# Altium project BRCM-V2-Master.PrjPCB
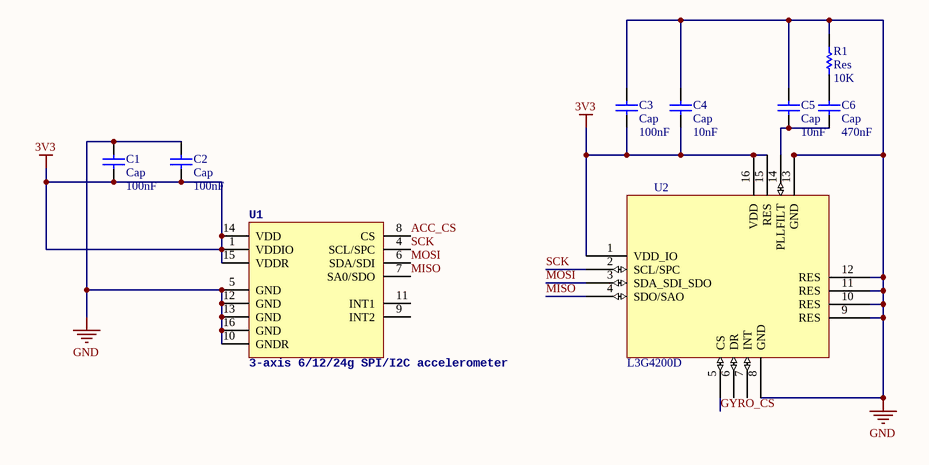
[diagram p0: IMU Sensor.SchDoc]
5 sheets, 95 parts. Net scope: global (net labels, ports and power ports of the same name join across sheets).
Board files: BRCM-V2-Master.PcbDoc, BRCM-V2.1-Master.PcbDoc
Sheets:
  IMU Sensor.SchDoc
  Power Conversion.SchDoc
  Dynamixel Power.SchDoc
  Communication.SchDoc
  Main System.SchDoc

## Sheet IMU Sensor.SchDoc
size A4

### Parts
C1  Cap  value 100nF  [0603-CAP]
C2  Cap  value 100nF  [0603-CAP]
C3  Cap  value 100nF  [0603-CAP]
C4  Cap  value 10nF  [0603-CAP]
C5  Cap  value 10nF  [0603-CAP]
C6  Cap  value 470nF  [0603-CAP]
R1  Res  value 10K  [0603-RES]
U1  3-axis 6/12/24g SPI/I2C accelerometer  [LGA16-3MM]
U2  L3G4200D  [L3G4200D]

### Nets
3V3: C1.1 C2.1 C3.1 C4.1 U1.1(VDDIO) U1.14(VDD) U1.15(VDDR) U2.1(VDD_IO) U2.15(RES) U2.16(VDD)
GND: C1.2 C2.2 C3.2 C4.2 C5.1 R1.2 U1.5(GND) U1.10(GNDR) U1.12(GND) U1.13(GND) U1.16(GND) U2.8(GND) U2.9(RES) U2.10(RES) U2.11(RES) U2.12(RES) U2.13(GND)
ACC_CS: U1.8(CS)
GYRO_CS: U2.5(CS)
MISO: U1.7(SA0/SDO) U2.4(SDO/SAO)
MOSI: U1.6(SDA/SDI) U2.3(SDA_SDI_SDO)
SCK: U1.4(SCL/SPC) U2.2(SCL/SPC)
NetC5_2: C5.2 C6.1 U2.14(PLLFILT)
NetC6_2: C6.2 R1.1

Not connected (* = marked no-connect by the designer): U1 9(INT2) 11(INT1); U2 6(DR) 7(INT)

### Library data of the parts
C1-C6 = Cap: Capacitor; Published: 8-Jun-2000; LatestRevisionDate: 17-Jul-2002; LatestRevisionNote: Re-released for DXP Platform.; PackageReference: RAD-0.3; Publisher: Altium Limited; PackageDescription: Radial Cap, Thru-Hole; 2 Leads; 0.3 in Pin Spacing
R1 = Res: Resistor; Published: 8-Jun-2000; LatestRevisionDate: 17-Jul-2002; LatestRevisionNote: Re-released for DXP Platform.; PackageReference: AXIAL-0.3; Publisher: Altium Limited; PackageDescription: Axial Device, Thru-Hole; 2 Leads; 0.3 in Pin Spacing
U1 = LIS331

## Sheet Power Conversion.SchDoc
size A4
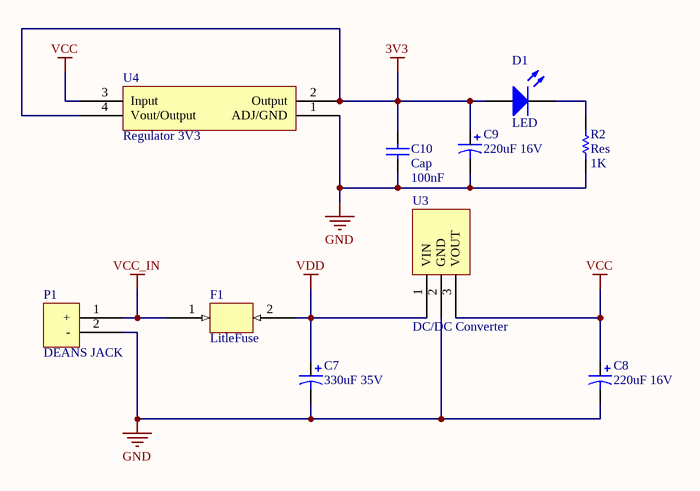
[diagram p1: Power Conversion.SchDoc]

### Parts
(Parts that share a designator on the sheet are numbered #1, #2 ... from top to bottom, then left to right.)
C7  330uF 35V  [CAP 330uF 35V SMD]
C8  220uF 16V  [CAP 220uF 16V]
C9  220uF 16V  [CAP 220uF 16V]
C10  Cap  value 100nF  [0603-CAP]
D1  LED  [CHIPLED_0603]
F1  LitleFuse  [LitleFuse]
P1  DEANS JACK  [Deans Jack]
R2  Res  value 1K  [0603-RES]
U3  DC/DC Converter  [DC/DC Converter]
U4#1  Regulator 3V3  [Regulator 3V3 SOT230]

### Nets
3V3: C9.1 C10.1 D1.1(A) U4#1.2(Output) U4#1.4(Vout/Output)
GND: C7.2 C8.2 C9.2 C10.2 P1.2(-) R2.1 U3.2(GND) U4#1.1(ADJ/GND)
VCC: C8.1 U3.3(VOUT) U4#1.3(Input)
VCC_IN: F1.1 P1.1(+)
VDD: C7.1 F1.2 U3.1(VIN)
NetD1_2: D1.2(K) R2.2

### Library data of the parts
C10 = Cap: Capacitor; Published: 8-Jun-2000; LatestRevisionDate: 17-Jul-2002; LatestRevisionNote: Re-released for DXP Platform.; PackageReference: RAD-0.3; Publisher: Altium Limited; PackageDescription: Radial Cap, Thru-Hole; 2 Leads; 0.3 in Pin Spacing
D1 = LED: Typical INFRARED GaAs LED; Published: 8-Jun-2000; LatestRevisionDate: 08-Jul-2005; LatestRevisionNote: Mech Layer 1 removed.; PackageReference: LED-0; Publisher: Altium Limited; PackageDescription: LED; 2 Leads
R2 = Res: Resistor; Published: 8-Jun-2000; LatestRevisionDate: 17-Jul-2002; LatestRevisionNote: Re-released for DXP Platform.; PackageReference: AXIAL-0.3; Publisher: Altium Limited; PackageDescription: Axial Device, Thru-Hole; 2 Leads; 0.3 in Pin Spacing

## Sheet Dynamixel Power.SchDoc
size A4
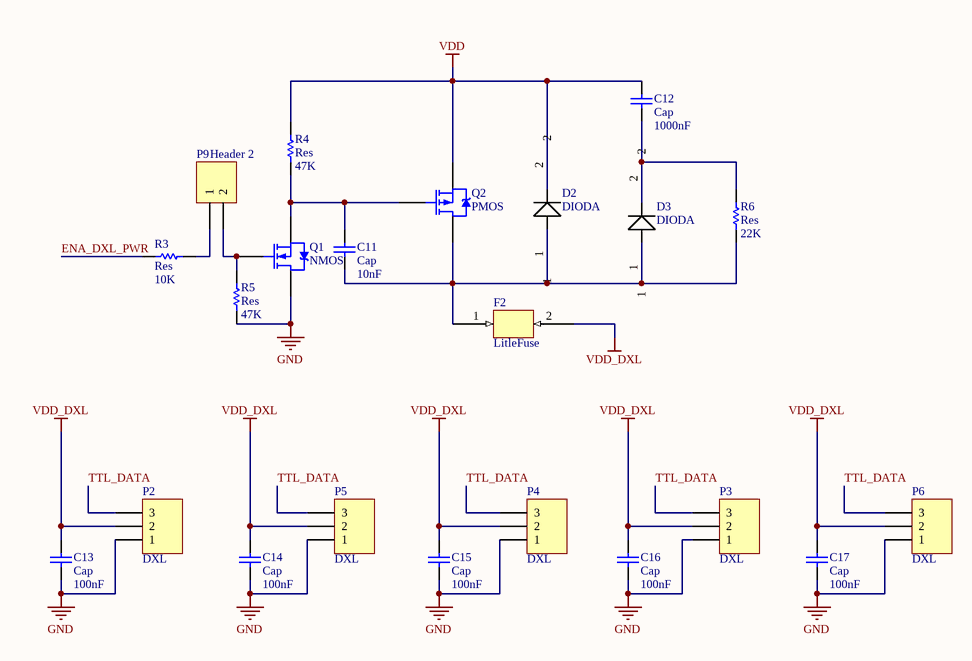
[diagram p2: Dynamixel Power.SchDoc]

### Parts
C11  Cap  value 10nF  [0603-CAP]
C12  Cap  value 1000nF  [0603-CAP]
C13  Cap  value 100nF  [0603-CAP]
C14  Cap  value 100nF  [0603-CAP]
C15  Cap  value 100nF  [0603-CAP]
C16  Cap  value 100nF  [0603-CAP]
C17  Cap  value 100nF  [0603-CAP]
D2  DIODA  [DIODE SS14 SODFL]
D3  DIODA  [DIODE SS14 SODFL]
F2  LitleFuse  [LitleFuse]
P2  DXL  [DXL]
P3  DXL  [DXL]
P4  DXL  [DXL]
P5  DXL  [DXL]
P6  DXL  [DXL]
P9  Header 2  [HDR1X2]
Q1  NMOS  [SOT23]
Q2  PMOS  [TO263]
R3  Res  value 10K  [0603-RES]
R4  Res  value 47K  [0603-RES]
R5  Res  value 47K  [0603-RES]
R6  Res  value 22K  [0603-RES]

### Nets
GND: C13.1 C14.1 C15.1 C16.1 C17.1 P2.1 P3.1 P4.1 P5.1 P6.1 Q1.3(D) R5.1
VDD: C12.2 D2.2 Q2.2(S) R4.2
VDD_DXL: C13.2 C14.2 C15.2 C16.2 C17.2 F2.2 P2.2 P3.2 P4.2 P5.2 P6.2
ENA_DXL_PWR: R3.1
TTL_DATA: P2.3 P3.3 P4.3 P5.3 P6.3
NetC11_1: C11.1 D2.1 D3.1 F2.1 Q2.3(D) R6.1
NetC11_2: C11.2 Q1.2(S) Q2.1(G) R4.1
NetC12_1: C12.1 D3.2 R6.2
NetP9_1: P9.1 R3.2
NetP9_2: P9.2 Q1.1(G) R5.2

### Library data of the parts
C11-C17 = Cap: Capacitor; Published: 8-Jun-2000; LatestRevisionDate: 17-Jul-2002; LatestRevisionNote: Re-released for DXP Platform.; PackageReference: RAD-0.3; Publisher: Altium Limited; PackageDescription: Radial Cap, Thru-Hole; 2 Leads; 0.3 in Pin Spacing
P9 = Header 2: Header, 2-Pin; LatestRevisionDate: 17-Jul-2002; LatestRevisionNote: Re-released for DXP Platform.; Publisher: Altium Limited
Q1 = NMOS: N-Channel Power MOSFET; Note: Pin 2 is electrically connected to pin 4.; Published: 8-Jun-2000; LatestRevisionDate: 17-Jul-2002; LatestRevisionNote: Re-released for DXP Platform.; DatasheetVersion: PD-9.814; PackageVersion: Feb-1997; PackageReference: TO-220AB; Publisher: Altium Limited; PackageDescription: TO, Thru-Hole, Vertical, Heatsink Mounted; 3 In-Line Leads; Pitch 2.54 mm; ComponentLink1Description: Manufacturer Link; ComponentLink1URL: http://www.irf.com/
Q2 = PMOS: P-Channel Power MOSFET; Note: Pin 4 not drawn and electrically connected to Pin 2.; Published: 8-Jun-2000; LatestRevisionDate: 17-Jul-2002; LatestRevisionNote: Re-released for DXP Platform.; DatasheetVersion: PD-9.390D; PackageVersion: Feb-1997; PackageReference: TO-220AB; Publisher: Altium Limited; PackageDescription: TO, Thru-Hole, Vertical, Heatsink Mounted; 3 In-Line Leads; Pitch 2.54 mm; ComponentLink1Description: Manufacturer Link; ComponentLink1URL: http://www.irf.com/
R3-R6 = Res: Resistor; Published: 8-Jun-2000; LatestRevisionDate: 17-Jul-2002; LatestRevisionNote: Re-released for DXP Platform.; PackageReference: AXIAL-0.3; Publisher: Altium Limited; PackageDescription: Axial Device, Thru-Hole; 2 Leads; 0.3 in Pin Spacing

## Sheet Communication.SchDoc
size A4
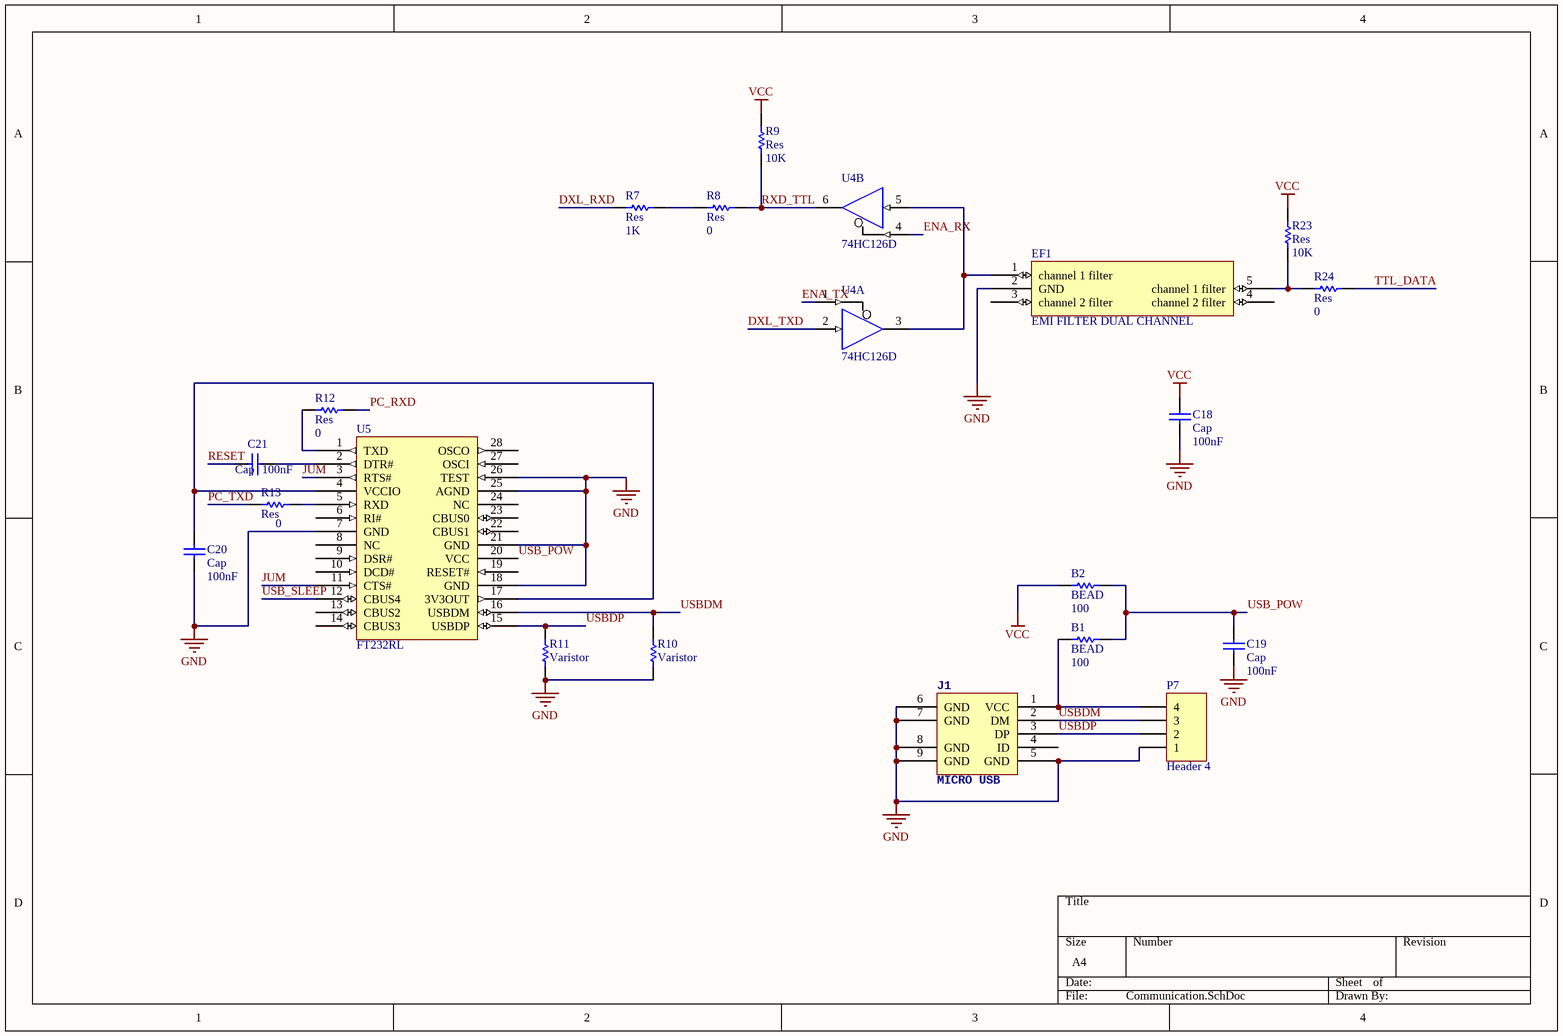
[diagram p3: Communication.SchDoc]

### Parts
(Parts that share a designator on the sheet are numbered #1, #2 ... from top to bottom, then left to right.)
B1  BEAD  value 100  [0603-RES]
B2  BEAD  value 100  [0603-RES]
C18  Cap  value 100nF  [0603-CAP]
C19  Cap  value 100nF  [0603-CAP]
C20  Cap  value 100nF  [0603-CAP]
C21  Cap  value 100nF  [0603-CAP]
EF1  EMI FILTER DUAL CHANNEL  [Emi Filter Dual Channel SOTFL]
J1  MICRO USB  [USB_MICRO]
P7  Header 4  [HDR1X4]
R7  Res  value 1K  [0603-RES]
R8  Res  value 0  [0603-RES]
R9  Res  value 10K  [0603-RES]
R10  Varistor  [0603-RES]
R11  Varistor  [0603-RES]
R12  Res  value 0  [0603-RES]
R13  Res  value 0  [0603-RES]
R23  Res  value 10K  [0603-RES]
R24  Res  value 0  [0603-RES]
U4#2  74HC126D  [14-SOIC]  (parts A,B of 4)
U5  FT232RL  [USB TO SERIAL FT232RL SOP]

### Nets
GND: C18.1 C19.1 C20.1 EF1.2(GND) J1.5(GND) J1.6(GND) J1.7(GND) J1.8(GND) J1.9(GND) P7.1 R10.1 R11.1 U4#2.7(GND) U5.7(GND) U5.18(GND) U5.21(GND) U5.25(AGND) U5.26(TEST)
VCC: B2.1 C18.2 R9.2 R23.2 U4#2.14(VCC)
DXL_RXD: R7.1
DXL_TXD: U4#2.2(A)
ENA_RX: U4#2.4(OE)
ENA_TX: U4#2.1(OE)
JUM: U5.3(RTS#) U5.11(CTS#)
PC_RXD: R12.2
PC_TXD: R13.2
RESET: C21.2
RXD_TTL: R8.2 R9.1 U4#2.6(Y)
TTL_DATA: R24.2
USB_POW: B1.2 B2.2 C19.2 U5.20(VCC)
USB_SLEEP: U5.12(CBUS4)
USBDM: J1.2(DM) P7.3 R10.2 U5.16(USBDM)
USBDP: J1.3(DP) P7.2 R11.2 U5.15(USBDP)
NetB1_1: B1.1 J1.1(VCC) P7.4
NetC20_2: C20.2 U5.4(VCCIO) U5.17(3V3OUT)
NetC21_1: C21.1 U5.2(DTR#)
NetEF1_1: EF1.1(channel_1_filter) U4#2.3(Y) U4#2.5(A)
NetEF1_5: EF1.5(channel_1_filter) R23.1 R24.1
NetR7_2: R7.2 R8.1
NetR12_1: R12.1 U5.1(TXD)
NetR13_1: R13.1 U5.5(RXD)

Not connected (* = marked no-connect by the designer): EF1 3(channel_2_filter) 4(channel_2_filter); J1 4(ID); U5 6(RI#) 8(NC) 9(DSR#) 10(DCD#) 13(CBUS2) 14(CBUS3) 19(RESET#) 22(CBUS1) 23(CBUS0) 24(NC) 27(OSCI) 28(OSCO)

### Library data of the parts
B1 B2 R7-R9 R12 R13 R23 R24 = Res: Resistor; Published: 8-Jun-2000; LatestRevisionDate: 17-Jul-2002; LatestRevisionNote: Re-released for DXP Platform.; PackageReference: AXIAL-0.3; Publisher: Altium Limited; PackageDescription: Axial Device, Thru-Hole; 2 Leads; 0.3 in Pin Spacing
C18-C21 = Cap: Capacitor; Published: 8-Jun-2000; LatestRevisionDate: 17-Jul-2002; LatestRevisionNote: Re-released for DXP Platform.; PackageReference: RAD-0.3; Publisher: Altium Limited; PackageDescription: Radial Cap, Thru-Hole; 2 Leads; 0.3 in Pin Spacing
P7 = Header 4: Header, 4-Pin; LatestRevisionDate: 17-Jul-2002; LatestRevisionNote: Re-released for DXP Platform.; Publisher: Altium Limited
R10 R11 = Res: Resistor; Value: 0; Published: 8-Jun-2000; LatestRevisionDate: 17-Jul-2002; LatestRevisionNote: Re-released for DXP Platform.; PackageReference: AXIAL-0.3; Publisher: Altium Limited; PackageDescription: Axial Device, Thru-Hole; 2 Leads; 0.3 in Pin Spacing
U4#2 = 74HC126D: Quadruple Bus Buffer Gate with 3-State Outputs; Published: 8-Jun-2000; LatestRevisionDate: 13-Apr-2006; LatestRevisionNote: IPC-7351 Footprint Added.; DatasheetVersion: Oct-1998; PackageVersion: Jan-1998; PackageReference: D014; Publisher: Altium Limited; PackageDescription: 14-Pin Small Outline Integrated Circuit 1.27 mm Pitch; Code_IPC: SOIC127P600-14; ComponentLink1Description: Manufacturer Link; ComponentLink1URL: http://www.ti.com/; ComponentLink2Description: Datasheet; ComponentLink2URL: http://www-s.ti.com/sc/ds/sn74ahct126.pdf

## Sheet Main System.SchDoc
size A4
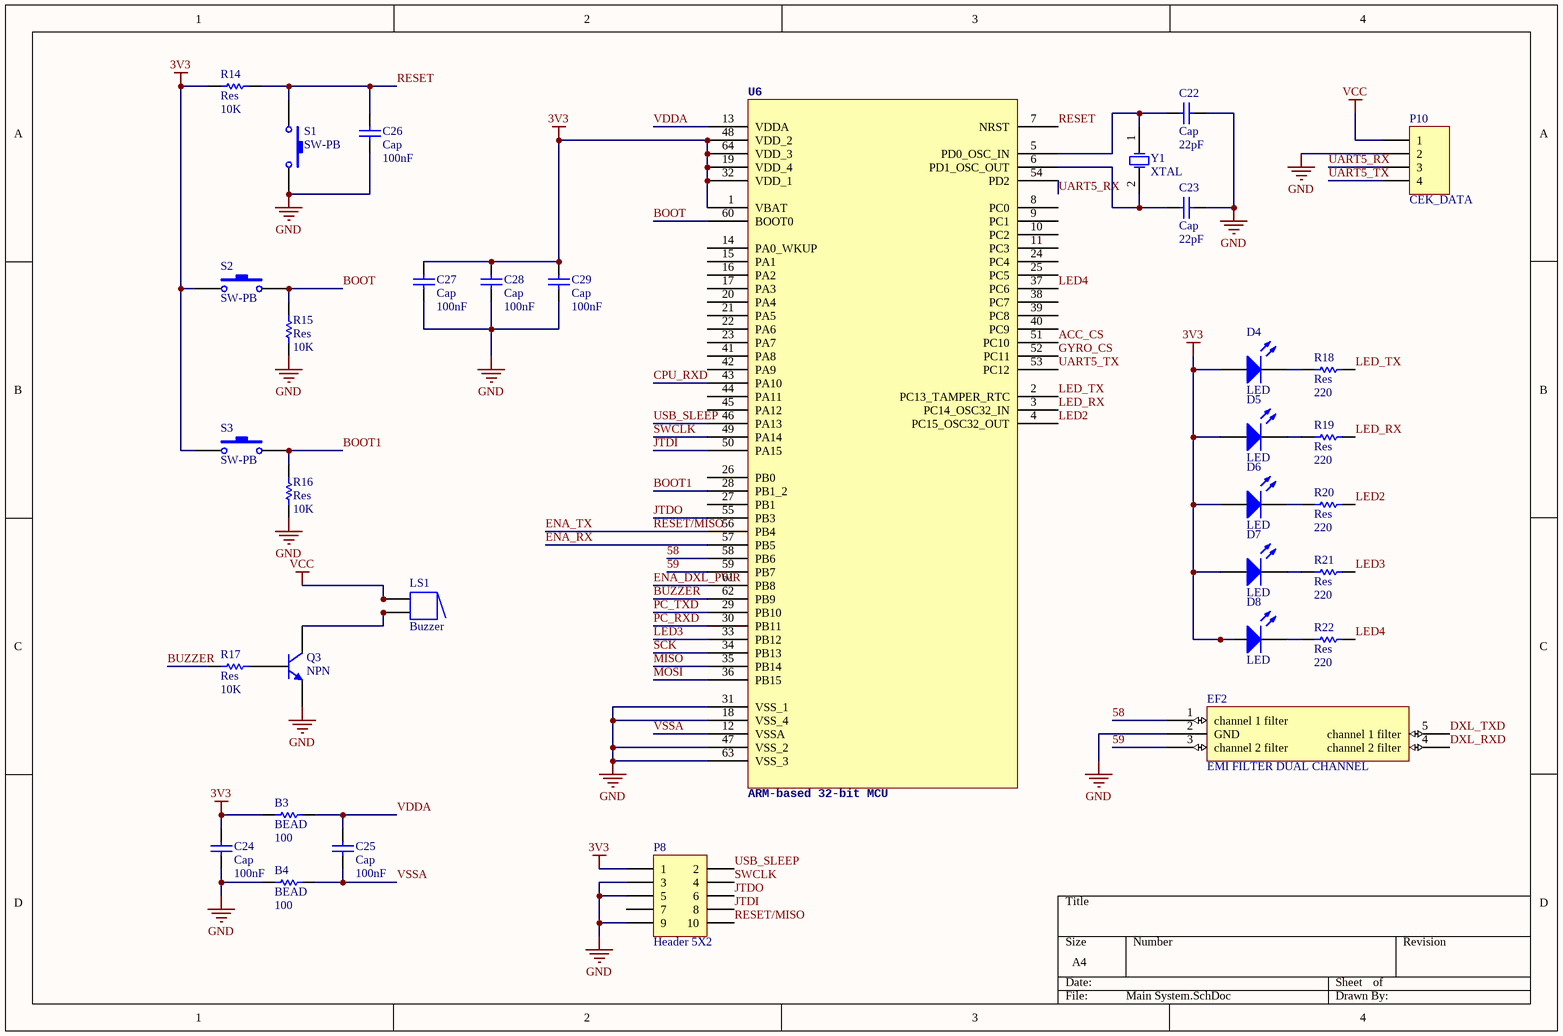
[diagram p4: Main System.SchDoc]

### Parts
B3  BEAD  value 100  [0603-RES]
B4  BEAD  value 100  [0603-RES]
C22  Cap  value 22pF  [0603-CAP]
C23  Cap  value 22pF  [0603-CAP]
C24  Cap  value 100nF  [0603-CAP]
C25  Cap  value 100nF  [0603-CAP]
C26  Cap  value 100nF  [0603-CAP]
C27  Cap  value 100nF  [0603-CAP]
C28  Cap  value 100nF  [0603-CAP]
C29  Cap  value 100nF  [0603-CAP]
D4  LED  [CHIPLED_0603]
D5  LED  [CHIPLED_0603]
D6  LED  [CHIPLED_0603]
D7  LED  [CHIPLED_0603]
D8  LED  [CHIPLED_0603]
EF2  EMI FILTER DUAL CHANNEL  [Emi Filter Dual Channel SOTFL]
LS1  Buzzer  [ABSM-1574]
P8  Header 5X2  [HDR2X5]
P10  CEK_DATA  [HDR1X4]
Q3  NPN  [SOT23]
R14  Res  value 10K  [0603-RES]
R15  Res  value 10K  [0603-RES]
R16  Res  value 10K  [0603-RES]
R17  Res  value 10K  [0603-RES]
R18  Res  value 220  [0603-RES]
R19  Res  value 220  [0603-RES]
R20  Res  value 220  [0603-RES]
R21  Res  value 220  [0603-RES]
R22  Res  value 220  [0603-RES]
S1  SW-PB  [TACTILE-SWITCH-SMD]
S2  SW-PB  [TACTILE-SWITCH-SMD]
S3  SW-PB  [TACTILE-SWITCH-SMD]
U6  ARM-based 32-bit MCU  [QFP-64N]
Y1  XTAL  [HC49US]

### Nets
3V3: B3.2 C24.2 C27.2 C28.2 C29.2 D4.1(A) D5.1(A) D6.1(A) D7.1(A) D8.1(A) P8.1 R14.1 S2.1 S3.1 U6.1(VBAT) U6.19(VDD_4) U6.32(VDD_1) U6.48(VDD_2) U6.64(VDD_3)
GND: B4.2 C22.2 C23.2 C24.1 C26.1 C27.1 C28.1 C29.1 EF2.2(GND) P8.3 P8.5 P8.9 P10.2 Q3.2(E) R15.1 R16.1 S1.3 U6.18(VSS_4) U6.31(VSS_1) U6.47(VSS_2) U6.63(VSS_3)
VCC: LS1.1 LS1.1A P10.1
58: EF2.1(channel_1_filter) U6.58(PB6)
59: EF2.3(channel_2_filter) U6.59(PB7)
ACC_CS: U6.51(PC10)
BOOT: R15.2 S2.3 U6.60(BOOT0)
BOOT1: R16.2 S3.3 U6.28(PB1_2)
BUZZER: R17.2 U6.62(PB9)
CPU_RXD: U6.43(PA10)
DXL_RXD: EF2.4(channel_2_filter)
DXL_TXD: EF2.5(channel_1_filter)
ENA_DXL_PWR: U6.61(PB8)
ENA_RX: U6.57(PB5)
ENA_TX: P8.10 U6.56(PB4)  [also labelled RESET/MISO]
GYRO_CS: U6.52(PC11)
JTDI: P8.8 U6.50(PA15)
JTDO: P8.6 U6.55(PB3)
LED2: R20.1 U6.4(PC15_OSC32_OUT)
LED3: R21.1 U6.33(PB12)
LED4: R22.1 U6.37(PC6)
LED_RX: R19.1 U6.3(PC14_OSC32_IN)
LED_TX: R18.1 U6.2(PC13_TAMPER_RTC)
MISO: U6.35(PB14)
MOSI: U6.36(PB15)
PC_RXD: U6.30(PB11)
PC_TXD: U6.29(PB10)
RESET: C26.2 R14.2 S1.1 U6.7(NRST)
SCK: U6.34(PB13)
SWCLK: P8.4 U6.49(PA14)
UART5_RX: P10.3 U6.54(PD2)
UART5_TX: P10.4 U6.53(PC12)
USB_SLEEP: P8.2 U6.46(PA13)
VDDA: B3.1 C25.2 U6.13(VDDA)
VSSA: B4.1 C25.1 U6.12(VSSA)
NetC22_1: C22.1 U6.5(PD0_OSC_IN) Y1.1(OSC1)
NetC23_1: C23.1 U6.6(PD1_OSC_OUT) Y1.2(OSC2)
NetD4_2: D4.2(K) R18.2
NetD5_2: D5.2(K) R19.2
NetD6_2: D6.2(K) R20.2
NetD7_2: D7.2(K) R21.2
NetD8_2: D8.2(K) R22.2
NetLS1_2: LS1.2 LS1.2A Q3.3(C)
NetQ3_1: Q3.1(B) R17.1

Not connected (* = marked no-connect by the designer): P8 7; U6 8(PC0) 9(PC1) 10(PC2) 11(PC3) 14(PA0_WKUP) 15(PA1) 16(PA2) 17(PA3) 20(PA4) 21(PA5) 22(PA6) 23(PA7) 24(PC4) 25(PC5) 26(PB0) 27(PB1) 38(PC7) 39(PC8) 40(PC9) 41(PA8) 42(PA9) 44(PA11) 45(PA12)

### Library data of the parts
B3 B4 R14-R22 = Res: Resistor; Published: 8-Jun-2000; LatestRevisionDate: 17-Jul-2002; LatestRevisionNote: Re-released for DXP Platform.; PackageReference: AXIAL-0.3; Publisher: Altium Limited; PackageDescription: Axial Device, Thru-Hole; 2 Leads; 0.3 in Pin Spacing
C22-C29 = Cap: Capacitor; Published: 8-Jun-2000; LatestRevisionDate: 17-Jul-2002; LatestRevisionNote: Re-released for DXP Platform.; PackageReference: RAD-0.3; Publisher: Altium Limited; PackageDescription: Radial Cap, Thru-Hole; 2 Leads; 0.3 in Pin Spacing
D4-D8 = LED: Typical INFRARED GaAs LED; Published: 8-Jun-2000; LatestRevisionDate: 08-Jul-2005; LatestRevisionNote: Mech Layer 1 removed.; PackageReference: LED-0; Publisher: Altium Limited; PackageDescription: LED; 2 Leads
LS1 = Buzzer: Magnetic Transducer Buzzer; Published: 24-Mar-1999; LatestRevisionDate: 17-Dec-2003; LatestRevisionNote: Schematic revised, PCB Footprint replaced.; DatasheetVersion: 17-Dec-2003; PackageReference: ABSM-1574; Publisher: Altium Limited; PackageDescription: Magnetic Transducer Buzzer; ComponentLink1Description: Manufacturer Link; ComponentLink1URL: http://www.megastar.com/linecard/buzzmode/index.php
P8 = Header 5X2: Header, 5-Pin, Dual row; LatestRevisionDate: 17-Jul-2002; LatestRevisionNote: Re-released for DXP Platform.; Publisher: Altium Limited
P10 = Header 4: Header, 4-Pin; LatestRevisionDate: 17-Jul-2002; LatestRevisionNote: Re-released for DXP Platform.; Publisher: Altium Limited
Q3 = NPN: NPN Bipolar Transistor; Published: 8-Jun-2000; LatestRevisionDate: 17-Jul-2002; LatestRevisionNote: Re-released for DXP Platform.; PackageReference: TO-226-AA; Publisher: Altium Limited; PackageDescription: TO, Flat Index; 3 In-Line, Axial Leads; Body Dia. 4.8mm; Leads 0.55 x 0.51 mm (max); Code_JEDEC: TO-226-AA
S1-S3 = SW-PB: Switch; Published: 24-Mar-1999; LatestRevisionDate: 17-Jul-2002; LatestRevisionNote: Re-released for DXP Platform.; PackageReference: SPST-2; Publisher: Altium Limited; PackageDescription: Switch; 2 Leads
U6 = STM32F103RET6: MPN: STM32F103RET6; OC_FARNELL: 1624138; OC_NEWARK: 01P4101; PACKAGE: QFP-64; SUPPLIER: STMICROELECTRONICS
Y1 = XTAL: Crystal Oscillator; Published: 8-Jun-2000; LatestRevisionDate: 17-Jul-2002; LatestRevisionNote: Re-released for DXP Platform.; PackageReference: R38; Publisher: Altium Limited; PackageDescription: Crystal, Thru-Hole; 2 Leads; Body 3.1 x 8.2 mm (Dia.xH)

## Nets that join several sheets
3V3: IMU Sensor (10 pins), Power Conversion (5 pins), Main System (19 pins)
GND: IMU Sensor (17 pins), Power Conversion (8 pins), Dynamixel Power (12 pins), Communication (18 pins), Main System (21 pins)
VCC: Power Conversion (C8.1 U3.3 U4#1.3), Communication (5 pins), Main System (LS1.1 LS1.1A P10.1)
VDD: Power Conversion (C7.1 F1.2 U3.1), Dynamixel Power (C12.2 D2.2 Q2.2 R4.2)
ACC_CS: IMU Sensor (U1.8), Main System (U6.51)
DXL_RXD: Communication (R7.1), Main System (EF2.4)
DXL_TXD: Communication (U4#2.2), Main System (EF2.5)
ENA_DXL_PWR: Dynamixel Power (R3.1), Main System (U6.61)
ENA_RX: Communication (U4#2.4), Main System (U6.57)
ENA_TX: Communication (U4#2.1), Main System (P8.10 U6.56)
GYRO_CS: IMU Sensor (U2.5), Main System (U6.52)
MISO: IMU Sensor (U1.7 U2.4), Main System (U6.35)
MOSI: IMU Sensor (U1.6 U2.3), Main System (U6.36)
PC_RXD: Communication (R12.2), Main System (U6.30)
PC_TXD: Communication (R13.2), Main System (U6.29)
RESET: Communication (C21.2), Main System (C26.2 R14.2 S1.1 U6.7)
SCK: IMU Sensor (U1.4 U2.2), Main System (U6.34)
TTL_DATA: Dynamixel Power (5 pins), Communication (R24.2)
USB_SLEEP: Communication (U5.12), Main System (P8.2 U6.46)